# EAGLE design Single-Thermocouple-Shield (EAGLE 6.1)
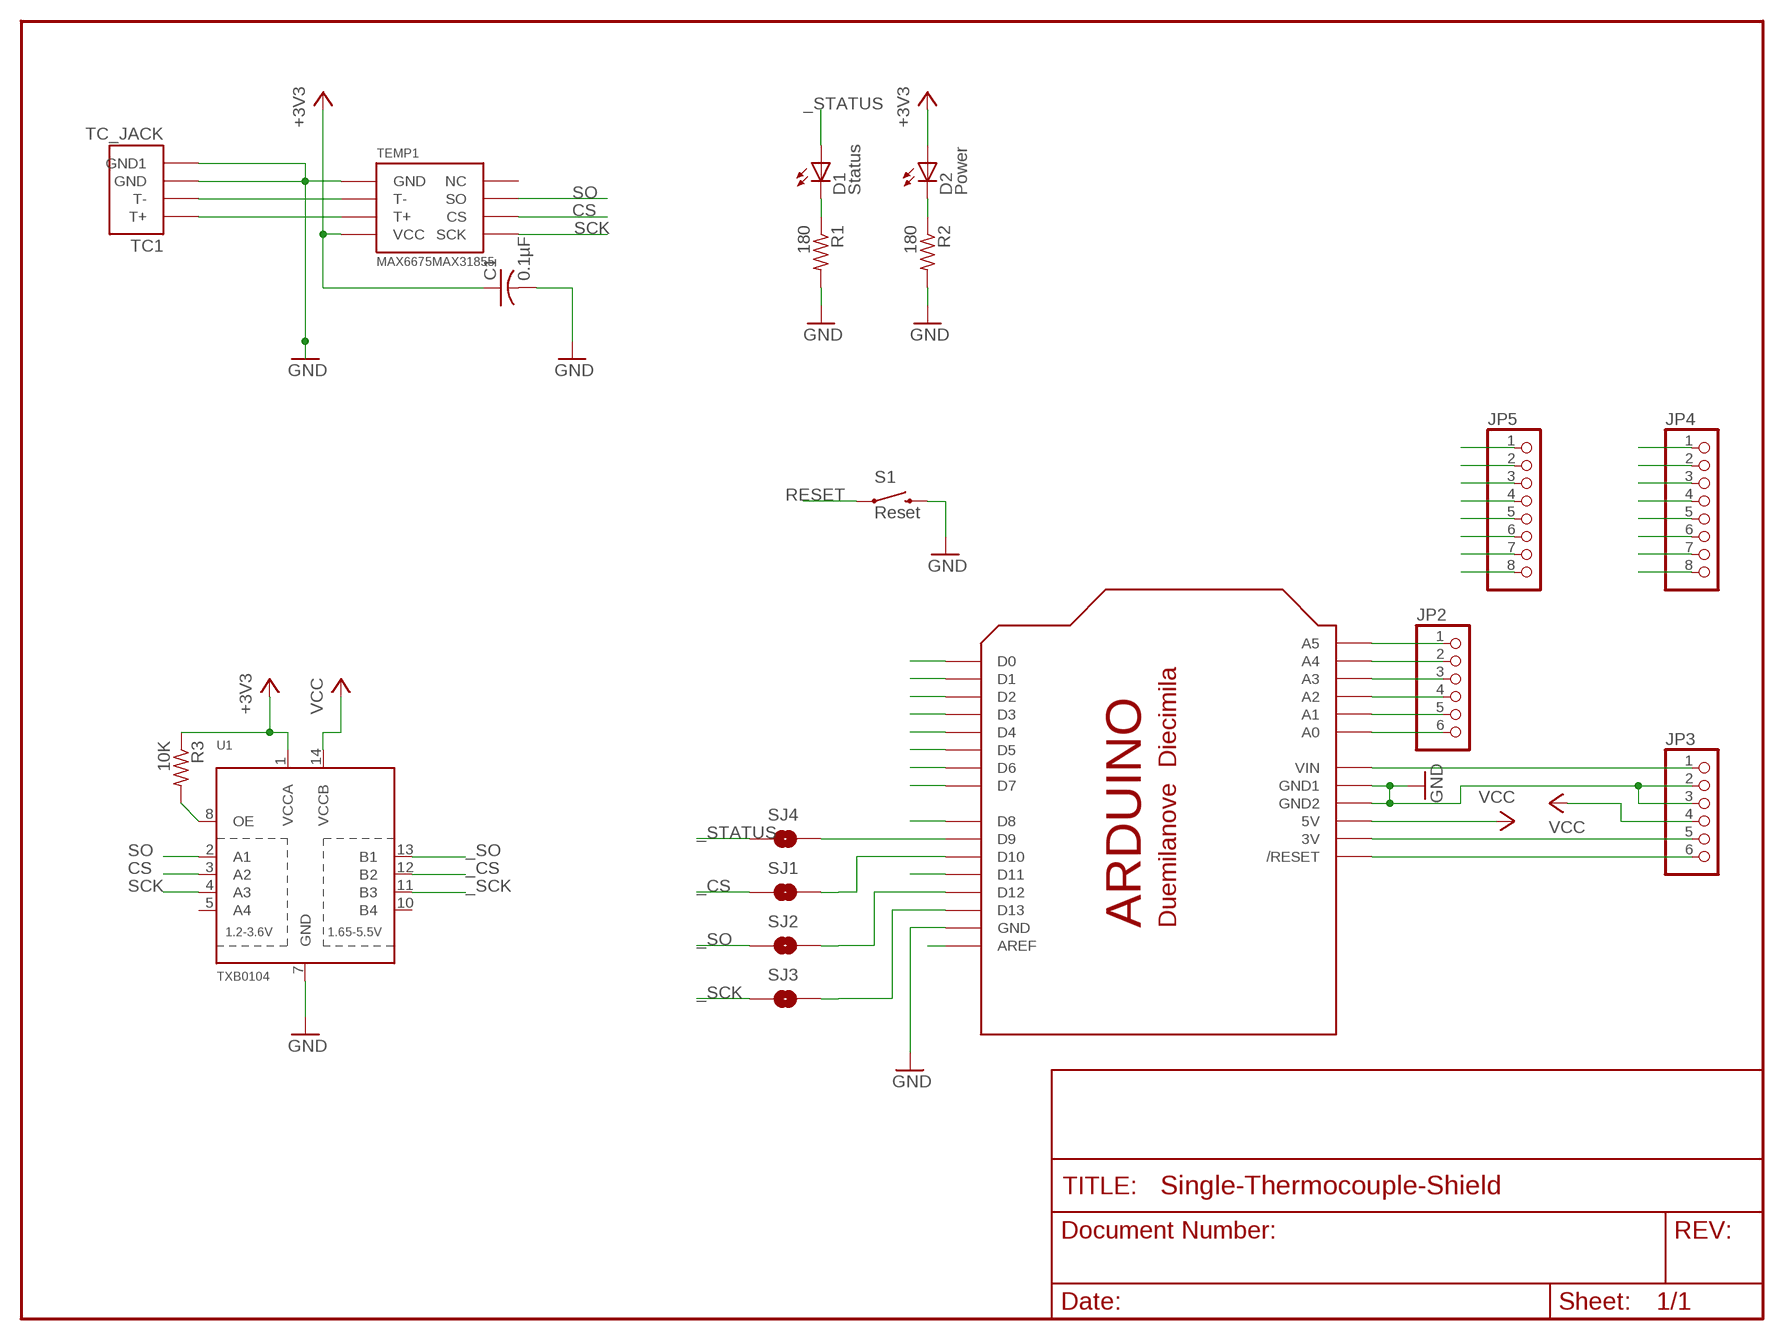
[diagram p0: schematic, sheet 1]

## Parts
C1  0.1µF  C-USC0603  [C0603]
D1  Status  LEDCHIPLED_0805  [CHIPLED_0805]
D2  Power  LEDCHIPLED_0805  [CHIPLED_0805]
JP2  PINHD-1X6CB  [1X06-CLEANBIG]
JP3  PINHD-1X6CB  [1X06-CLEANBIG]
JP4  PINHD-1X8CLEANBIG  [1X08-CLEANBIG]
JP5  PINHD-1X8CLEANBIG  [1X08-CLEANBIG]
R1  180  R-US_R0603  [R0603]
R2  180  R-US_R0603  [R0603]
R3  10K  R-US_R0603  [R0603]
S1  Reset  SWITCH-MOMENTARY-2SMD  [TACTILE_SWITCH_SMD]
SJ1  SOLDERJUMPERTRACE  [SJ_2S-TRACE]
SJ2  SOLDERJUMPERTRACE  [SJ_2S-TRACE]
SJ3  SOLDERJUMPERTRACE  [SJ_2S-TRACE]
SJ4  SOLDERJUMPERTRACE  [SJ_2S-TRACE]
TC1  TC_JACK  [TC_JACK]
TEMP1  MAX6675MAX31855  [SOIC-8]
U1  TXB0104  TXB0104PWR  [TSSOP14]
U$3  ARDUINOUNO  [ARDUINO]

## Nets
+3V3: C1.1 D2.A JP3.5 R3.1 TEMP1.VCC U1.1(VCCA) U$3.3V
_CS: SJ1.1 U1.12(B2)
_SCK: SJ3.1 U1.11(B3)
_SO: SJ2.1 U1.13(B1)
_STATUS: D1.A SJ4.1
AREF: JP4.8 U$3.AREF
CS: TEMP1.CS U1.3(A2)
D0: JP5.1 U$3.D0
D1: JP5.2 U$3.D1
D2: JP5.3 U$3.D2
D3: JP5.4 U$3.D3
D4: JP5.5 U$3.D4
D5: JP5.6 U$3.D5
D6: JP5.7 U$3.D6
D7: JP5.8 U$3.D7
D8: JP4.1 U$3.D8
D9: JP4.2 SJ4.2 U$3.D9
D10: JP4.3 SJ1.2 U$3.D10
D11: JP4.4 U$3.D11
D12: JP4.5 SJ2.2 U$3.D12
D13: JP4.6 SJ3.2 U$3.D13
GND: C1.2 JP3.2 JP3.3 JP4.7 R1.2 R2.2 S1.3 TC1.P$1(GND) TC1.P$2(GND1) TEMP1.GND U1.7(GND) U$3.GND U$3.GND1 U$3.GND2
N$2: D1.C R1.1
N$3: JP2.1 U$3.A5
N$6: JP2.2 U$3.A4
N$7: D2.C R2.1
N$9: JP2.3 U$3.A3
N$12: JP2.4 U$3.A2
N$114: R3.2 U1.8(OE)
N$126: JP2.5 U$3.A1
N$127: JP2.6 U$3.A0
N$128: JP3.1 U$3.VIN
RESET: JP3.6 S1.1 U$3.RESET(/RESET)
SCK: TEMP1.SCK U1.4(A3)
SO: TEMP1.SO U1.2(A1)
T1+: TC1.T+ TEMP1.T+
T1-: TC1.T- TEMP1.T-
VCC: JP3.4 U1.14(VCCB) U$3.5V
Unconnected: TEMP1.NC U1.5(A4) U1.10(B4)

## Library data of the parts
C1 = resistor:C-US: CAPACITOR, American symbol
D1 D2 = led:LED: LED OSRAM: - CHIPLED LG R971, LG N971, LY N971, LG Q971, LY Q971, LO R971, LY R971 LH N974, LH R974 LS Q976, LO Q976, LY Q976 LO Q996 - Hyper CHIPLED LW Q18S LB Q993, LB Q99A, LB R99A - SideLED LS A670, LO A670, LY A670, LG A670, LP A670 LB A673, LV A673, LT A673, LW A673 LH A674 LY A675 LS A676, LA A676, LO A676, LY A676, LW A676 LS A679, LY A679, LG A679 - Hyper Micro SIDELED® LS Y876, LA Y876, LO Y876, LY Y876 LT Y87S - SmartLED LW L88C, LW L88S LB L89C, LB L89S, LG L890 LS L89K, LO L89K, LY L89K LS L896, LA L896, LO L896, LY L896 - TOPLED LS T670, LO T670, LY T670, LG T670, LP T670 LSG T670, LSP T670, LSY T670, LOP T670, LYG T670 LG T671, LOG T671, LSG T671 LB T673, LV T673, LT T673, LW T673 LH T674 LS T676, LA T676, LO T676, LY T676, LB T676, LH T676, LSB T676, LW T676 LB T67C, LV T67C, LT T67C, LS T67K, LO T67K, LY T67K, LW E67C LS E67B, LA E67B, LO E67B, LY E67B, LB E67C, LV E67C, LT E67C LW T67C LS T679, LY T679, LG T679 LS T770, LO T770, LY T770, LG T770, LP T770 LB T773, LV T773, LT T773, LW T773 LH T774 LS E675, LA E675, LY E675, LS T675 LS T776, LA T776, LO T776, LY T776, LB T776 LHGB T686 LT T68C, LB T68C - Hyper Mini TOPLED® LB M676 - Mini TOPLED Santana® LG M470 LS M47K, LO M47K, LY M47K Source: http://www.osram.convergy.de LUXEON: - LUMILED® LXK2-PW12-R00, LXK2-PW12-S00, LXK2-PW14-U00, LXK2-PW14-V00 LXK2-PM12-R00, LXK2-PM12-S00, LXK2-PM14-U00 LXK2-PE12-Q00, LXK2-PE12-R00, LXK2-PE12-S00, LXK2-PE14-T00, LXK2-PE14-U00 LXK2-PB12-K00, LXK2-PB12-L00, LXK2-PB12-M00, LXK2-PB14-N00, LXK2-PB14-P00, LXK2-PB14-Q00 LXK2-PR12-L00, LXK2-PR12-M00, LXK2-PR14-Q00, LXK2-PR14-R00 LXK2-PD12-Q00, LXK2-PD12-R00, LXK2-PD12-S00 LXK2-PH12-R00, LXK2-PH12-S00 LXK2-PL12-P00, LXK2-PL12-Q00, LXK2-PL12-R00 Source: www.luxeon.com KINGBRIGHT: KA-3528ASYC Source: www.kingbright.com
JP2 JP3 = adafruit:PINHD-1X6: PIN HEADER
JP4 JP5 = adafruit:PINHD-1X8: PIN HEADER
R1-R3 = resistor:R-US_: RESISTOR, American symbol
S1 = SparkFun:SWITCH-MOMENTARY-2
SJ1-SJ4 = SparkFun:SOLDERJUMPER: Solder Jumper Standard SMD solder jumper. Used to automate production. Two varients : Normally Open and Normally Closed are the same, but have different paste layers. NC will have a large amount of paste and should jumper during reflow.
TC1 = McLEng:TC_JACK
TEMP1 = McLEng:MAX6675
U1 = McLEng:TXB0104PWR: 4-Bit Bi-Directional Level Shifter 1.2V-3.6V (VCCA) to 1.65V-5.5V (VCCB) bi-directional level shifter with auto direction sensing. Max data rate - VCCA 1.8V: 20Mbps (50ns), VCCA 3.3V: 100Mbps (10ns) Digikey: 296-21929-1-ND
U$3 = adafruit:ARDUINO: Arduino Diecimila/Duemilanove Make a shield with ease, this package has all the named pins as well as the two mounting drill holes and an outline of the USB and DC power connector. The outline is on the DIMENSION layer, so if your board house uses it they will cut the outline to match. http://www.ladyada.net/library/pcb/eaglelibrary.html

## Board
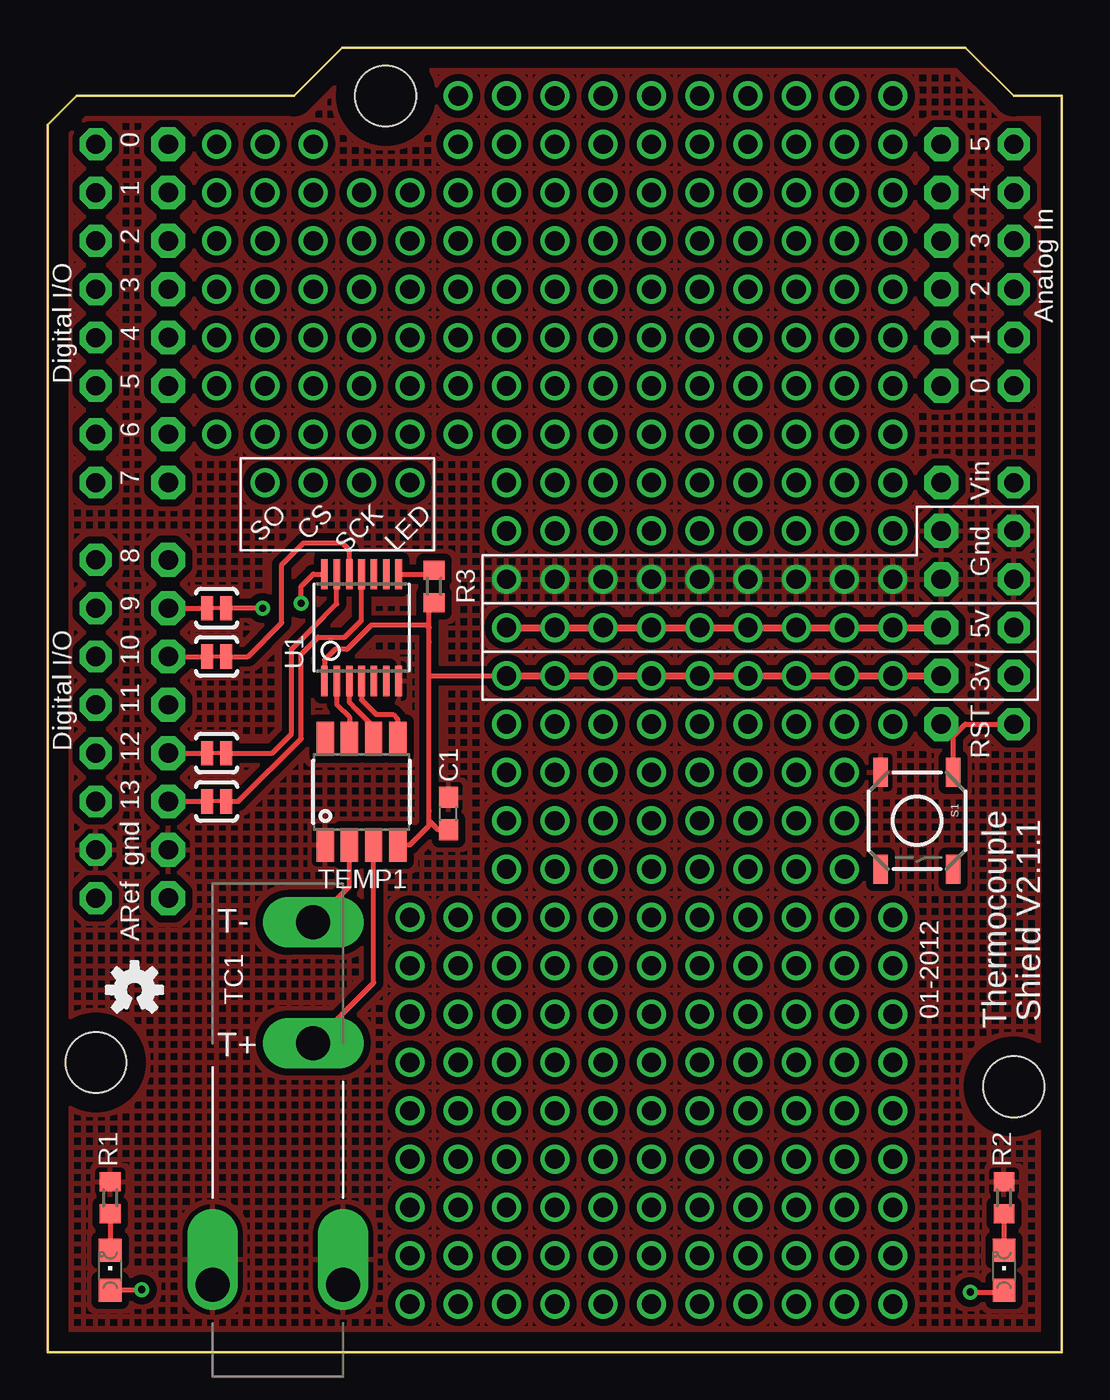
[diagram p1: board, top side]
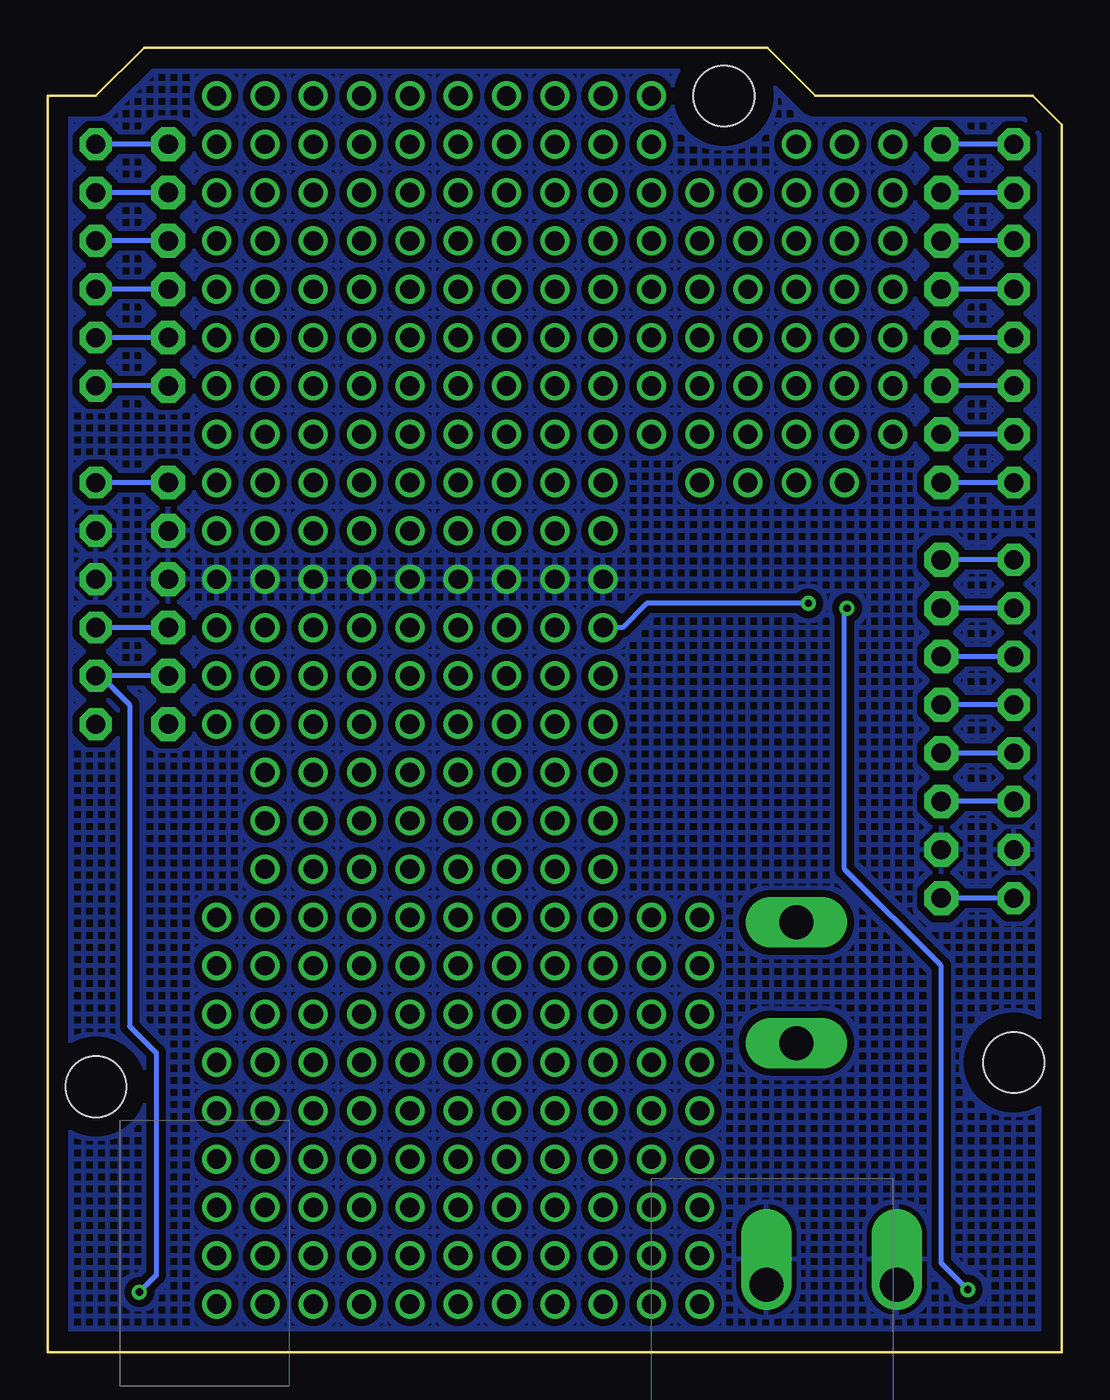
[diagram p2: board, bottom side, seen from below]

Size 53.34 x 68.58 mm. Coordinates in mm from the lower left corner, seen from the top.
Outline: 0,0 53.34,0 53.34,66.04 50.8,66.04 48.26,68.58 15.49,68.58 12.95,66.04 1.52,66.04 0,64.52 0,0
Copper layers (1*16): Top 0.035mm / dielectric 1.5mm / Bottom 0.035mm
Design rules: minimum track width 10mil, minimum drill 15mil, track to track 10mil, track to pad 10mil, pad to pad 8mil, via to via 10mil, smd to smd 8mil, copper to edge 40mil, drill to drill 10mil, minimum pad ring 10mil, minimum via ring 8mil, stop-mask expansion 4mil, vias tented up to drill 25mil, thermal gap 10mil
tRestrict: area 0,22.9 to 0.6,64.8; area 52.7,31.8 to 53.3,66
bRestrict: area 0,22.9 to 0.6,64.8; area 52.7,31.8 to 53.3,66

### Footprints (pad centres in the part's own frame; a part is rotated, then mirrored left to right if it is on the bottom)
C0603 = smd 1.1 x 1: 1 -0.85,0; 2 0.85,0
CHIPLED_0805 = smd 1.2 x 1.2: A 0,-1.05; C 0,1.05
1X06-CLEANBIG = drill 1.016 pad 1.778 octagon: 1 -6.35,0; 2 -3.81,0; 3 -1.27,0; 4 1.27,0; 5 3.81,0; 6 6.35,0
1X08-CLEANBIG = drill 1.016 pad 1.778 octagon: 1 -8.89,0; 2 -6.35,0; 3 -3.81,0; 4 -1.27,0; 5 1.27,0; 6 3.81,0; 7 6.35,0; 8 8.89,0
R0603 = smd 1 x 1.1: 1 -0.85,0; 2 0.85,0
TACTILE_SWITCH_SMD = smd 1.524 x 0.762: 1 -2.54,1.905; 2 2.54,1.905; 3 -2.54,-1.905; 4 2.54,-1.905
SJ_2S-TRACE = smd 0.635 x 1.27: 1 -0.508,0; 2 0.508,0
TC_JACK = drill 1.778 offset: P$1 -5.283,0; P$2 1.575,0 | drill 1.778 long: T+ 0,12.7; T- 0,19.05
SOIC-8 = smd 1.778 x 0.914: CS 2.794,-0.635; GND -2.794,1.905; NC 2.794,1.905; SCK 2.794,-1.905; SO 2.794,0.635; T+ -2.794,-0.635; T- -2.794,0.635; VCC -2.794,-1.905
TSSOP14 = smd 0.35 x 1.6: 1 -1.95,-2.8; 2 -1.3,-2.8; 3 -0.65,-2.8; 4 0,-2.8; 5 0.65,-2.8; 6 1.3,-2.8; 7 1.95,-2.8; 8 1.95,2.8; 9 1.3,2.8; 10 0.65,2.8; 11 0,2.8; 12 -0.65,2.8; 13 -1.3,2.8; 14 -1.95,2.8
ARDUINO = drill 1 pad 1.676 octagon: 3V 35.56,2.54; 5V 38.1,2.54; A0 50.8,2.54; A1 53.34,2.54; A2 55.88,2.54; A3 58.42,2.54; A4 60.96,2.54; A5 63.5,2.54; AREF 23.876,50.8; D0 63.5,50.8; D1 60.96,50.8; D2 58.42,50.8; D3 55.88,50.8; D4 53.34,50.8; D5 50.8,50.8; D6 48.26,50.8; D7 45.72,50.8; D8 41.656,50.8; D9 39.116,50.8; D10 36.576,50.8; D11 34.036,50.8; D12 31.496,50.8; D13 28.956,50.8; GND 26.416,50.8; GND1 43.18,2.54; GND2 40.64,2.54; RESET 33.02,2.54; VIN 45.72,2.54 | hole 3.2: 15.24,50.8; 66.04,35.56; 13.97,2.54

### Placement (x,y rotation side)
C1  21.08,28.32 90 top
D1  3.3,4.32 0 top
D2  50.29,4.32 0 top
JP2  46.99,57.15 270 top
JP3  46.99,39.37 270 top
JP4  6.35,32.77 270 top
JP5  6.35,54.61 270 top
R1  3.3,8.13 90 top
R2  50.29,8.13 90 top
R3  20.32,40.26 90 top
S1  45.72,27.94 270 top
SJ1  8.89,36.58 180 top
SJ2  8.89,31.5 180 top
SJ3  8.89,28.96 180 top
SJ4  8.89,39.12 180 top
TC1  13.97,3.56 0 top
TEMP1  16.51,29.46 90 top
U1  16.51,38.1 0 top
U$2  [OSHW-LOGO-S]  4.57,19.05 0 top
U$3  53.34,0 90 top

### Tracks (layer width: path | path; a pad name or v marks a point on that pad's centre or on a via)
+3V3  (via drill 0.38 pad 0.79, 1.02)
  Top 0.254: v48.51,3.17 50.2,3.17 D2.A | 20.07,35.56 20.07,28.45 20.07,27.94 | 20.07,35.56 20.07,37.33 20.07,38.1 | 20.07,35.56 v24.13,35.56 | C1.1 20.54,27.47 20.07,27.94 | 20.07,27.94 20.07,27.69 19.05,26.67 TEMP1.VCC | 20.07,38.1 20.07,39.16 R3.1 | U1.1 14.56,36.4 15.11,36.96 15.75,36.96 17.02,38.23 19.94,38.23 20.07,38.1
  Top 0.381: v24.13,35.56 v26.67,35.56 v29.21,35.56 v31.75,35.56 v34.29,35.56 v36.83,35.56 v39.37,35.56 v41.91,35.56 v44.45,35.56 JP3.5
  Bottom 0.254: JP3.5 U$3.3V 50.55,35.56 49.02,34.04 49.02,17.14 47.62,15.75 47.62,4.06 v48.51,3.17
_CS
  Top 0.254: U1.12 15.86,42.18 15.49,42.55 13.46,42.55 12.32,41.4 12.32,38.35 10.54,36.58 SJ1.1
_SCK
  Top 0.254: U1.11 16.51,38.48 15.62,37.59 14.22,37.59 13.34,36.7 13.34,32.26 10.03,28.96 SJ3.1
_SO
  Top 0.254: SJ2.1 11.81,31.5 12.83,32.51 12.83,36.96 13.97,38.1 15.21,39.34 U1.13
_STATUS  (via drill 0.38, 0.38 pad 0.79)
  Top 0.254: v4.95,3.3 3.34,3.3 D1.A | v11.3,39.12 SJ4.1
  Bottom 0.254: v4.95,3.3 6.35,4.7 6.35,20.32 11.43,25.4 11.43,38.99 v11.3,39.12
AREF
  Bottom 0.254: U$3.AREF JP4.8
CS
  Top 0.254: TEMP1.CS 17.14,32.89 16.26,33.78 15.88,34.16 15.88,35.28 U1.3
D0
  Bottom 0.254: U$3.D0 JP5.1
D1
  Bottom 0.254: U$3.D1 JP5.2
D2
  Bottom 0.254: U$3.D2 JP5.3
D3
  Bottom 0.254: U$3.D3 JP5.4
D4
  Bottom 0.254: U$3.D4 JP5.5
D5
  Bottom 0.254: U$3.D5 JP5.6
D6
  Bottom 0.254: U$3.D6 JP5.7
D7
  Bottom 0.254: U$3.D7 JP5.8
D8
  Bottom 0.254: U$3.D8 JP4.1
D9
  Top 0.254: JP4.2 SJ4.2
  Bottom 0.254: U$3.D9 JP4.2
D10
  Top 0.254: JP4.3 SJ1.2
  Bottom 0.254: U$3.D10 JP4.3
D11
  Bottom 0.254: U$3.D11 JP4.4
D12
  Top 0.254: JP4.5 SJ2.2
  Bottom 0.254: U$3.D12 JP4.5
D13
  Top 0.254: JP4.6 SJ3.2
  Bottom 0.254: U$3.D13 JP4.6
GND  (via drill 1.02)
  other vias: 24.13,40.64 26.67,40.64 29.21,40.64 31.75,40.64 34.29,40.64 36.83,40.64 39.37,40.64 41.91,40.64 44.45,40.64
  pour Bottom (isolate 0.381, hatched): 0,0 53.34,0 53.34,66.04 50.8,66.04 48.26,68.58 15.49,68.58 12.95,66.04 1.52,66.04 0,64.52
  pour Top (isolate 0.381, hatched): 0,0 53.34,0 53.34,66.04 50.8,66.04 48.26,68.58 15.49,68.58 12.95,66.04 1.52,66.04 0,64.52
N$1  (via drill 1.02)
  other vias: 11.43,50.8
N$2
  Top 0.254: R1.1 D1.C
N$3
  Bottom 0.254: JP2.1 U$3.A5
N$4  (via drill 1.02)
  other vias: 13.97,50.8
N$5  (via drill 1.02)
  other vias: 16.51,50.8
N$6
  Bottom 0.254: JP2.2 U$3.A4
N$7
  Top 0.254: R2.1 D2.C
N$8  (via drill 1.02)
  other vias: 19.05,50.8
N$9
  Bottom 0.254: JP2.3 U$3.A3
N$10  (via drill 1.02)
  other vias: 21.59,50.8
N$11  (via drill 1.02)
  other vias: 24.13,50.8
N$12
  Bottom 0.254: JP2.4 U$3.A2
N$13  (via drill 1.02)
  other vias: 26.67,50.8
N$14  (via drill 1.02)
  other vias: 29.21,50.8
N$15  (via drill 1.02)
  other vias: 31.75,50.8
N$16  (via drill 1.02)
  other vias: 34.29,50.8
N$17  (via drill 1.02)
  other vias: 36.83,50.8
N$18  (via drill 1.02)
  other vias: 39.37,50.8
N$19  (via drill 1.02)
  other vias: 41.91,50.8
N$20  (via drill 1.02)
  other vias: 44.45,50.8
N$21  (via drill 1.02)
  other vias: 11.43,53.34
N$22  (via drill 1.02)
  other vias: 13.97,53.34
N$23  (via drill 1.02)
  other vias: 16.51,53.34
N$24  (via drill 1.02)
  other vias: 19.05,53.34
N$25  (via drill 1.02)
  other vias: 21.59,53.34
N$26  (via drill 1.02)
  other vias: 24.13,53.34
N$27  (via drill 1.02)
  other vias: 26.67,53.34
N$28  (via drill 1.02)
  other vias: 29.21,53.34
N$29  (via drill 1.02)
  other vias: 31.75,53.34
N$30  (via drill 1.02)
  other vias: 34.29,53.34
N$31  (via drill 1.02)
  other vias: 36.83,53.34
N$32  (via drill 1.02)
  other vias: 39.37,53.34
N$33  (via drill 1.02)
  other vias: 41.91,53.34
N$34  (via drill 1.02)
  other vias: 44.45,53.34
N$35  (via drill 1.02)
  other vias: 11.43,55.88
N$36  (via drill 1.02)
  other vias: 13.97,55.88
N$37  (via drill 1.02)
  other vias: 16.51,55.88
N$38  (via drill 1.02)
  other vias: 19.05,55.88
N$39  (via drill 1.02)
  other vias: 21.59,55.88
N$40  (via drill 1.02)
  other vias: 24.13,55.88
N$41  (via drill 1.02)
  other vias: 26.67,55.88
N$42  (via drill 1.02)
  other vias: 29.21,55.88
N$43  (via drill 1.02)
  other vias: 31.75,55.88
N$44  (via drill 1.02)
  other vias: 34.29,55.88
N$45  (via drill 1.02)
  other vias: 36.83,55.88
N$46  (via drill 1.02)
  other vias: 39.37,55.88
N$47  (via drill 1.02)
  other vias: 41.91,55.88
N$48  (via drill 1.02)
  other vias: 44.45,55.88
N$49  (via drill 1.02)
  other vias: 11.43,58.42
N$50  (via drill 1.02)
  other vias: 13.97,58.42
N$51  (via drill 1.02)
  other vias: 16.51,58.42
N$52  (via drill 1.02)
  other vias: 19.05,58.42
N$53  (via drill 1.02)
  other vias: 21.59,58.42
N$54  (via drill 1.02)
  other vias: 24.13,58.42
N$55  (via drill 1.02)
  other vias: 26.67,58.42
N$56  (via drill 1.02)
  other vias: 29.21,58.42
N$57  (via drill 1.02)
  other vias: 31.75,58.42
N$58  (via drill 1.02)
  other vias: 34.29,58.42
N$59  (via drill 1.02)
  other vias: 36.83,58.42
N$60  (via drill 1.02)
  other vias: 39.37,58.42
N$61  (via drill 1.02)
  other vias: 41.91,58.42
N$62  (via drill 1.02)
  other vias: 44.45,58.42
N$63  (via drill 1.02)
  other vias: 11.43,60.96
N$64  (via drill 1.02)
  other vias: 13.97,60.96
N$65  (via drill 1.02)
  other vias: 16.51,60.96
N$66  (via drill 1.02)
  other vias: 19.05,60.96
N$67  (via drill 1.02)
  other vias: 21.59,60.96
N$68  (via drill 1.02)
  other vias: 24.13,60.96
N$69  (via drill 1.02)
  other vias: 26.67,60.96
N$70  (via drill 1.02)
  other vias: 29.21,60.96
N$71  (via drill 1.02)
  other vias: 31.75,60.96
N$72  (via drill 1.02)
  other vias: 34.29,60.96
N$73  (via drill 1.02)
  other vias: 36.83,60.96
N$74  (via drill 1.02)
  other vias: 39.37,60.96
N$75  (via drill 1.02)
  other vias: 41.91,60.96
N$76  (via drill 1.02)
  other vias: 44.45,63.5
N$77  (via drill 1.02)
  other vias: 11.43,63.5
N$78  (via drill 1.02)
  other vias: 13.97,63.5
N$79  (via drill 1.02)
  other vias: 8.89,50.8
N$80  (via drill 1.02)
  other vias: 8.89,53.34
N$81  (via drill 1.02)
  other vias: 21.59,63.5
N$82  (via drill 1.02)
  other vias: 24.13,63.5
N$83  (via drill 1.02)
  other vias: 26.67,63.5
N$84  (via drill 1.02)
  other vias: 29.21,63.5
N$85  (via drill 1.02)
  other vias: 31.75,63.5
N$86  (via drill 1.02)
  other vias: 34.29,63.5
N$87  (via drill 1.02)
  other vias: 36.83,63.5
N$88  (via drill 1.02)
  other vias: 39.37,63.5
N$89  (via drill 1.02)
  other vias: 41.91,63.5
N$90  (via drill 1.02)
  other vias: 8.89,55.88
N$91  (via drill 1.02)
  other vias: 8.89,58.42
N$92  (via drill 1.02)
  other vias: 24.13,66.04
N$93  (via drill 1.02)
  other vias: 26.67,66.04
N$94  (via drill 1.02)
  other vias: 29.21,66.04
N$95  (via drill 1.02)
  other vias: 31.75,66.04
N$96  (via drill 1.02)
  other vias: 34.29,66.04
N$97  (via drill 1.02)
  other vias: 36.83,66.04
N$98  (via drill 1.02)
  other vias: 39.37,66.04
N$99  (via drill 1.02)
  other vias: 41.91,66.04
N$100  (via drill 1.02)
  other vias: 8.89,60.96
N$101  (via drill 1.02)
  other vias: 8.89,63.5
N$102  (via drill 1.02)
  other vias: 21.59,66.04
N$103  (via drill 1.02)
  other vias: 13.97,48.26
N$104  (via drill 1.02)
  other vias: 21.59,48.26
N$105  (via drill 1.02)
  other vias: 24.13,48.26
N$106  (via drill 1.02)
  other vias: 26.67,48.26
N$107  (via drill 1.02)
  other vias: 29.21,48.26
N$108  (via drill 1.02)
  other vias: 31.75,48.26
N$109  (via drill 1.02)
  other vias: 34.29,48.26
N$110  (via drill 1.02)
  other vias: 36.83,48.26
N$111  (via drill 1.02)
  other vias: 39.37,48.26
N$112  (via drill 1.02)
  other vias: 41.91,48.26
N$113  (via drill 1.02)
  other vias: 44.45,48.26
N$114
  Top 0.254: U1.8 20.11,40.9 R3.2
N$115  (via drill 1.02)
  other vias: 24.13,30.48
N$116  (via drill 1.02)
  other vias: 26.67,30.48
N$117  (via drill 1.02)
  other vias: 29.21,30.48
N$118  (via drill 1.02)
  other vias: 31.75,30.48
N$119  (via drill 1.02)
  other vias: 34.29,30.48
N$120  (via drill 1.02)
  other vias: 36.83,30.48
N$121  (via drill 1.02)
  other vias: 39.37,30.48
N$122  (via drill 1.02)
  other vias: 16.51,48.26
N$123  (via drill 1.02)
  other vias: 19.05,48.26
N$124  (via drill 1.02)
  other vias: 44.45,66.04
N$125  (via drill 1.02)
  other vias: 44.45,60.96
N$126
  Bottom 0.254: JP2.5 U$3.A1
N$127
  Bottom 0.254: JP2.6 U$3.A0
N$128
  Bottom 0.254: JP3.1 U$3.VIN
N$129  (via drill 1.02)
  other vias: 41.91,30.48
N$130  (via drill 1.02)
  other vias: 8.89,48.26
N$131  (via drill 1.02)
  other vias: 24.13,33.02
N$132  (via drill 1.02)
  other vias: 26.67,33.02
N$133  (via drill 1.02)
  other vias: 29.21,33.02
N$134  (via drill 1.02)
  other vias: 31.75,33.02
N$135  (via drill 1.02)
  other vias: 34.29,33.02
N$136  (via drill 1.02)
  other vias: 36.83,33.02
N$137  (via drill 1.02)
  other vias: 39.37,33.02
N$138  (via drill 1.02)
  other vias: 41.91,33.02
N$139  (via drill 1.02)
  other vias: 44.45,33.02
N$140  (via drill 1.02)
  other vias: 13.97,45.72
N$149  (via drill 1.02)
  other vias: 11.43,45.72
N$166  (via drill 1.02)
  other vias: 24.13,43.18
N$167  (via drill 1.02)
  other vias: 26.67,43.18
N$168  (via drill 1.02)
  other vias: 29.21,43.18
N$169  (via drill 1.02)
  other vias: 31.75,43.18
N$170  (via drill 1.02)
  other vias: 34.29,43.18
N$171  (via drill 1.02)
  other vias: 36.83,43.18
N$172  (via drill 1.02)
  other vias: 39.37,43.18
N$173  (via drill 1.02)
  other vias: 41.91,43.18
N$174  (via drill 1.02)
  other vias: 26.67,45.72
N$175  (via drill 1.02)
  other vias: 29.21,45.72
N$176  (via drill 1.02)
  other vias: 31.75,45.72
N$177  (via drill 1.02)
  other vias: 34.29,45.72
N$178  (via drill 1.02)
  other vias: 36.83,45.72
N$179  (via drill 1.02)
  other vias: 39.37,45.72
N$180  (via drill 1.02)
  other vias: 41.91,45.72
N$181  (via drill 1.02)
  other vias: 24.13,27.94
N$182  (via drill 1.02)
  other vias: 26.67,27.94
N$183  (via drill 1.02)
  other vias: 29.21,27.94
N$184  (via drill 1.02)
  other vias: 31.75,27.94
N$185  (via drill 1.02)
  other vias: 34.29,27.94
N$186  (via drill 1.02)
  other vias: 36.83,27.94
N$187  (via drill 1.02)
  other vias: 39.37,27.94
N$188  (via drill 1.02)
  other vias: 41.91,27.94
N$189  (via drill 1.02)
  other vias: 11.43,48.26
N$190  (via drill 1.02)
  other vias: 44.45,45.72
N$191  (via drill 1.02)
  other vias: 44.45,43.18
N$193  (via drill 1.02)
  other vias: 16.51,45.72
N$194  (via drill 1.02)
  other vias: 24.13,10.16
N$195  (via drill 1.02)
  other vias: 26.67,10.16
N$196  (via drill 1.02)
  other vias: 29.21,10.16
N$197  (via drill 1.02)
  other vias: 31.75,10.16
N$198  (via drill 1.02)
  other vias: 34.29,10.16
N$199  (via drill 1.02)
  other vias: 36.83,10.16
N$200  (via drill 1.02)
  other vias: 39.37,10.16
N$201  (via drill 1.02)
  other vias: 41.91,10.16
N$202  (via drill 1.02)
  other vias: 44.45,10.16
N$203  (via drill 1.02)
  other vias: 24.13,12.7
N$204  (via drill 1.02)
  other vias: 26.67,12.7
N$205  (via drill 1.02)
  other vias: 29.21,12.7
N$206  (via drill 1.02)
  other vias: 31.75,12.7
N$207  (via drill 1.02)
  other vias: 34.29,12.7
N$208  (via drill 1.02)
  other vias: 36.83,12.7
N$209  (via drill 1.02)
  other vias: 39.37,12.7
N$210  (via drill 1.02)
  other vias: 41.91,12.7
N$211  (via drill 1.02)
  other vias: 44.45,12.7
N$212  (via drill 1.02)
  other vias: 24.13,15.24
N$213  (via drill 1.02)
  other vias: 26.67,15.24
N$214  (via drill 1.02)
  other vias: 29.21,15.24
N$215  (via drill 1.02)
  other vias: 31.75,15.24
N$216  (via drill 1.02)
  other vias: 34.29,15.24
N$217  (via drill 1.02)
  other vias: 36.83,15.24
N$218  (via drill 1.02)
  other vias: 39.37,15.24
N$219  (via drill 1.02)
  other vias: 41.91,15.24
N$220  (via drill 1.02)
  other vias: 44.45,15.24
N$221  (via drill 1.02)
  other vias: 24.13,17.78
N$222  (via drill 1.02)
  other vias: 26.67,17.78
N$223  (via drill 1.02)
  other vias: 29.21,17.78
N$224  (via drill 1.02)
  other vias: 31.75,17.78
N$225  (via drill 1.02)
  other vias: 34.29,17.78
N$226  (via drill 1.02)
  other vias: 36.83,17.78
N$227  (via drill 1.02)
  other vias: 39.37,17.78
N$228  (via drill 1.02)
  other vias: 41.91,17.78
N$229  (via drill 1.02)
  other vias: 44.45,17.78
N$230  (via drill 1.02)
  other vias: 24.13,20.32
N$231  (via drill 1.02)
  other vias: 26.67,20.32
N$232  (via drill 1.02)
  other vias: 29.21,20.32
N$233  (via drill 1.02)
  other vias: 31.75,20.32
N$234  (via drill 1.02)
  other vias: 34.29,20.32
N$235  (via drill 1.02)
  other vias: 36.83,20.32
N$236  (via drill 1.02)
  other vias: 39.37,20.32
N$237  (via drill 1.02)
  other vias: 41.91,20.32
N$238  (via drill 1.02)
  other vias: 24.13,22.86
N$239  (via drill 1.02)
  other vias: 26.67,22.86
N$240  (via drill 1.02)
  other vias: 29.21,22.86
N$241  (via drill 1.02)
  other vias: 31.75,22.86
N$242  (via drill 1.02)
  other vias: 34.29,22.86
N$243  (via drill 1.02)
  other vias: 36.83,22.86
N$244  (via drill 1.02)
  other vias: 39.37,22.86
N$245  (via drill 1.02)
  other vias: 41.91,22.86
N$246  (via drill 1.02)
  other vias: 26.67,25.4
N$247  (via drill 1.02)
  other vias: 29.21,25.4
N$248  (via drill 1.02)
  other vias: 31.75,25.4
N$249  (via drill 1.02)
  other vias: 34.29,25.4
N$250  (via drill 1.02)
  other vias: 36.83,25.4
N$251  (via drill 1.02)
  other vias: 39.37,25.4
N$252  (via drill 1.02)
  other vias: 41.91,25.4
N$253  (via drill 1.02)
  other vias: 24.13,7.62
N$254  (via drill 1.02)
  other vias: 26.67,7.62
N$255  (via drill 1.02)
  other vias: 29.21,7.62
N$256  (via drill 1.02)
  other vias: 31.75,7.62
N$257  (via drill 1.02)
  other vias: 34.29,7.62
N$258  (via drill 1.02)
  other vias: 36.83,7.62
N$259  (via drill 1.02)
  other vias: 39.37,7.62
N$260  (via drill 1.02)
  other vias: 41.91,7.62
N$261  (via drill 1.02)
  other vias: 44.45,7.62
N$262  (via drill 1.02)
  other vias: 24.13,5.08
N$263  (via drill 1.02)
  other vias: 44.45,22.86
N$264  (via drill 1.02)
  other vias: 44.45,20.32
N$265  (via drill 1.02)
  other vias: 24.13,25.4
N$266  (via drill 1.02)
  other vias: 26.67,5.08
N$267  (via drill 1.02)
  other vias: 29.21,5.08
N$268  (via drill 1.02)
  other vias: 31.75,5.08
N$269  (via drill 1.02)
  other vias: 34.29,5.08
N$270  (via drill 1.02)
  other vias: 36.83,5.08
N$271  (via drill 1.02)
  other vias: 39.37,5.08
N$272  (via drill 1.02)
  other vias: 41.91,5.08
N$273  (via drill 1.02)
  other vias: 44.45,5.08
N$274  (via drill 1.02)
  other vias: 24.13,2.54
N$275  (via drill 1.02)
  other vias: 26.67,2.54
N$276  (via drill 1.02)
  other vias: 29.21,2.54
N$277  (via drill 1.02)
  other vias: 31.75,2.54
N$278  (via drill 1.02)
  other vias: 34.29,2.54
N$279  (via drill 1.02)
  other vias: 36.83,2.54
N$280  (via drill 1.02)
  other vias: 39.37,2.54
N$281  (via drill 1.02)
  other vias: 41.91,2.54
N$282  (via drill 1.02)
  other vias: 44.45,2.54
N$283  (via drill 1.02)
  other vias: 19.05,10.16
N$284  (via drill 1.02)
  other vias: 21.59,10.16
N$285  (via drill 1.02)
  other vias: 19.05,12.7
N$286  (via drill 1.02)
  other vias: 21.59,12.7
N$287  (via drill 1.02)
  other vias: 19.05,15.24
N$288  (via drill 1.02)
  other vias: 21.59,15.24
N$289  (via drill 1.02)
  other vias: 19.05,17.78
N$290  (via drill 1.02)
  other vias: 21.59,17.78
N$291  (via drill 1.02)
  other vias: 19.05,20.32
N$292  (via drill 1.02)
  other vias: 21.59,20.32
N$293  (via drill 1.02)
  other vias: 19.05,22.86
N$294  (via drill 1.02)
  other vias: 21.59,22.86
N$295  (via drill 1.02)
  other vias: 19.05,7.62
N$296  (via drill 1.02)
  other vias: 21.59,7.62
N$297  (via drill 1.02)
  other vias: 19.05,5.08
N$298  (via drill 1.02)
  other vias: 21.59,5.08
N$299  (via drill 1.02)
  other vias: 19.05,2.54
N$300  (via drill 1.02)
  other vias: 21.59,2.54
N$301  (via drill 1.02)
  other vias: 19.05,45.72
N$302  (via drill 1.02)
  other vias: 24.13,45.72
RESET
  Top 0.254: S1.1 47.62,32.38 | 47.62,32.38 JP3.6 | U$3.RESET 48.26,33.02 47.62,32.38
SCK
  Top 0.254: U1.4 16.51,34.29 17.27,33.53 18.16,33.53 18.41,33.27 TEMP1.SCK
SO
  Top 0.254: U1.2 15.21,34.07 15.88,33.4 TEMP1.SO
T1+
  Top 0.254: TC1.T+ 17.14,19.43 TEMP1.T+
T1-
  Top 0.254: TC1.T- 15.88,24.51 TEMP1.T-
VCC  (via drill 0.38 pad 0.79, 1.02)
  Top 0.254: U1.14 13.98,40.9 13.34,40.26 v13.34,39.37
  Top 0.381: JP3.4 v44.45,38.1 v41.91,38.1 v39.37,38.1 v36.83,38.1 v34.29,38.1 v31.75,38.1 v29.21,38.1 v26.67,38.1 v24.13,38.1
  Bottom 0.254: JP3.4 U$3.5V | v13.34,39.37 21.84,39.37 23.11,38.1 v24.13,38.1

### Text on the board
tPlace: 01-2012 | Thermocouple | Shield V2.1.1
tNames: SO | CS | SCK | LED